# Altium schematic sheet Sheet1.SchDoc
size B; Author: Феликс Лазарев; DrawnBy: Феликс Лазарев; Revision: 1; DocumentName: Контроллер  СF на ПЗУ
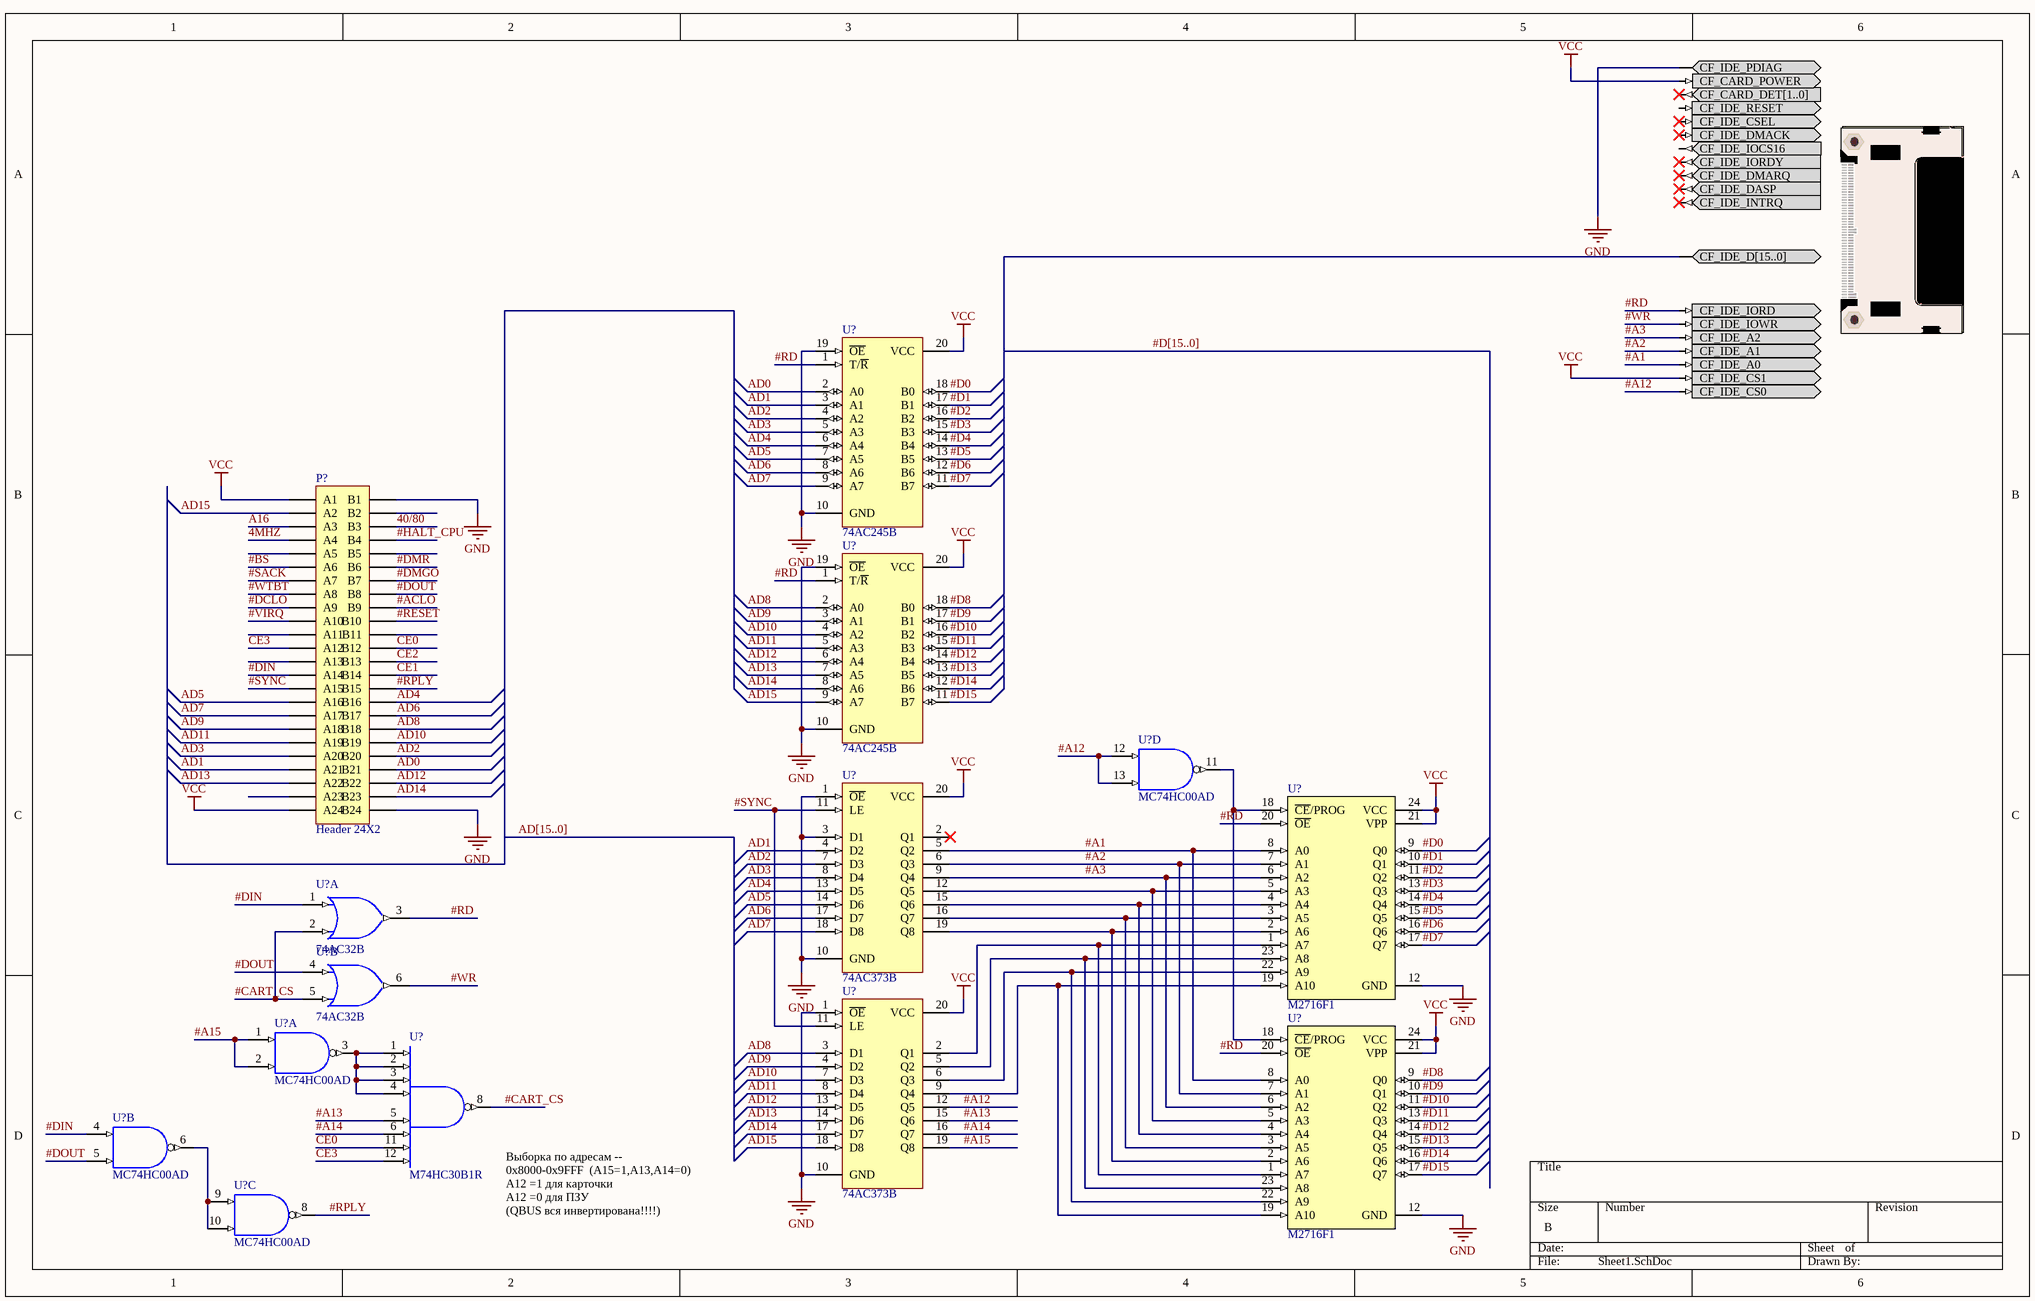
[diagram p0: Sheet1.SchDoc]

## Parts
(Parts that share a designator on the sheet are numbered #1, #2 ... from top to bottom, then left to right.)
?  COMPACT_FLASH  (value not drawn)
P?  Header 24X2  [HDR2X24]
U?#1  74AC245B  [DIP20]
U?#2  74AC245B  [DIP20]
U?#3  MC74HC00AD  [751A-03_N]  (part D of 4)
U?#4  74AC373B  [DIP20]
U?#5  M2716F1  [FDIP24W]
U?#6  74AC32B  [DIP14]  (part A of 4)
U?#7  74AC32B  [DIP14]  (part B of 4)
U?#8  74AC373B  [DIP20]
U?#9  MC74HC00AD  [751A-03_N]  (part A of 4)
U?#10  M2716F1  [FDIP24W]
U?#11  M74HC30B1R  [DIP14]
U?#12  MC74HC00AD  [751A-03_N]  (part B of 4)
U?#13  MC74HC00AD  [751A-03_N]  (part C of 4)

## Nets
GND: ?.CF_IDE_PDIAG P?.2(B1) P?.48(B24) U?#1.10(GND) U?#1.19(~{OE}) U?#2.10(GND) U?#2.19(~{OE}) U?#3.7(GND) U?#4.1(~{OE}) U?#4.3(D1) U?#4.10(GND) U?#5.12(GND) U?#6.7(GND) U?#7.7(GND) U?#8.1(~{OE}) U?#8.10(GND) U?#9.7(GND) U?#10.12(GND) U?#11.7(GND) U?#12.7(GND) U?#13.7(GND)
VCC: ?.CF_CARD_POWER ?.CF_IDE_CS1 P?.1(A1) P?.47(A24) U?#1.20(VCC) U?#2.20(VCC) U?#3.14(VCC) U?#4.20(VCC) U?#5.21(VPP) U?#5.24(VCC) U?#6.14(VCC) U?#7.14(VCC) U?#8.20(VCC) U?#9.14(VCC) U?#10.21(VPP) U?#10.24(VCC) U?#11.14(VCC) U?#12.14(VCC) U?#13.14(VCC)
4MHZ: P?.7(A4)
40/80: P?.6(B3)
#A1: ?.CF_IDE_A0 U?#4.5(Q2) U?#5.8(A0) U?#10.8(A0)
#A2: ?.CF_IDE_A1 U?#4.6(Q3) U?#5.7(A1) U?#10.7(A1)
#A3: ?.CF_IDE_A2 U?#4.9(Q4) U?#5.6(A2) U?#10.6(A2)
#A12: ?.CF_IDE_CS0 U?#3.12(A) U?#3.13(B) U?#8.12(Q5)
#A13: U?#8.15(Q6) U?#11.5(E)
#A14: U?#8.16(Q7) U?#11.6(F)
#A15: U?#8.19(Q8) U?#9.1(A) U?#9.2(B)
#ACLO: P?.18(B9)
#BS: P?.11(A6)
#CART_CS: U?#6.2(B) U?#7.5(B) U?#11.8(Y)
#D0: U?#1.18(B0) U?#5.9(Q0)
#D1: U?#1.17(B1) U?#5.10(Q1)
#D2: U?#1.16(B2) U?#5.11(Q2)
#D3: U?#1.15(B3) U?#5.13(Q3)
#D4: U?#1.14(B4) U?#5.14(Q4)
#D5: U?#1.13(B5) U?#5.15(Q5)
#D6: U?#1.12(B6) U?#5.16(Q6)
#D7: U?#1.11(B7) U?#5.17(Q7)
#D8: U?#2.18(B0) U?#10.9(Q0)
#D9: U?#2.17(B1) U?#10.10(Q1)
#D10: U?#2.16(B2) U?#10.11(Q2)
#D11: U?#2.15(B3) U?#10.13(Q3)
#D12: U?#2.14(B4) U?#10.14(Q4)
#D13: U?#2.13(B5) U?#10.15(Q5)
#D14: U?#2.12(B6) U?#10.16(Q6)
#D15: U?#2.11(B7) U?#10.17(Q7)
#D[15..0]: ?.CF_IDE_D[15..0]
#DCLO: P?.17(A9)
#DIN: P?.27(A14) U?#6.1(A) U?#12.4(A)
#DMGO: P?.14(B7)
#DMR: P?.12(B6)
#DOUT: P?.16(B8) U?#7.4(A) U?#12.5(B)
#HALT_CPU: P?.8(B4)
#RD: ?.CF_IDE_IORD U?#1.1(T/~{R}) U?#2.1(T/~{R}) U?#5.20(~{OE}) U?#6.3(Y) U?#10.20(~{OE})
#RESET: P?.20(B10)
#RPLY: P?.30(B15) U?#13.8(~{Y})
#SACK: P?.13(A7)
#SYNC: P?.29(A15) U?#4.11(LE) U?#8.11(LE)
#VIRQ: P?.19(A10)
#WR: ?.CF_IDE_IOWR U?#7.6(Y)
#WTBT: P?.15(A8)
A16: P?.5(A3)
AD0: P?.42(B21) U?#1.2(A0)
AD1: P?.41(A21) U?#1.3(A1) U?#4.4(D2)
AD2: P?.40(B20) U?#1.4(A2) U?#4.7(D3)
AD3: P?.39(A20) U?#1.5(A3) U?#4.8(D4)
AD4: P?.32(B16) U?#1.6(A4) U?#4.13(D5)
AD5: P?.31(A16) U?#1.7(A5) U?#4.14(D6)
AD6: P?.34(B17) U?#1.8(A6) U?#4.17(D7)
AD7: P?.33(A17) U?#1.9(A7) U?#4.18(D8)
AD8: P?.36(B18) U?#2.2(A0) U?#8.3(D1)
AD9: P?.35(A18) U?#2.3(A1) U?#8.4(D2)
AD10: P?.38(B19) U?#2.4(A2) U?#8.7(D3)
AD11: P?.37(A19) U?#2.5(A3) U?#8.8(D4)
AD12: P?.44(B22) U?#2.6(A4) U?#8.13(D5)
AD13: P?.43(A22) U?#2.7(A5) U?#8.14(D6)
AD14: P?.46(B23) U?#2.8(A6) U?#8.17(D7)
AD15: P?.3(A2) U?#2.9(A7) U?#8.18(D8)
CE0: P?.24(B12) U?#11.11(G)
CE1: P?.28(B14)
CE2: P?.26(B13)
CE3: P?.23(A12) U?#11.12(H)
NetU?#3_11: U?#3.11(~{Y}) U?#5.18(~{CE}/PROG) U?#10.18(~{CE}/PROG)
NetU?#4_12: U?#4.12(Q5) U?#5.5(A3) U?#10.5(A3)
NetU?#4_15: U?#4.15(Q6) U?#5.4(A4) U?#10.4(A4)
NetU?#4_16: U?#4.16(Q7) U?#5.3(A5) U?#10.3(A5)
NetU?#4_19: U?#4.19(Q8) U?#5.2(A6) U?#10.2(A6)
NetU?#5_1: U?#5.1(A7) U?#8.2(Q1) U?#10.1(A7)
NetU?#5_19: U?#5.19(A10) U?#8.9(Q4) U?#10.19(A10)
NetU?#5_22: U?#5.22(A9) U?#8.6(Q3) U?#10.22(A9)
NetU?#5_23: U?#5.23(A8) U?#8.5(Q2) U?#10.23(A8)
NetU?#9_3: U?#9.3(~{Y}) U?#11.1(A) U?#11.2(B) U?#11.3(C) U?#11.4(D)
NetU?#12_6: U?#12.6(~{Y}) U?#13.9(A) U?#13.10(B)

Not connected (* = marked no-connect by the designer): ? CF_CARD_DET[1..0]* CF_IDE_CSEL* CF_IDE_DASP* CF_IDE_DMACK* CF_IDE_DMARQ* CF_IDE_INTRQ* CF_IDE_IOCS16 CF_IDE_IORDY* CF_IDE_RESET; P? 4(B2) 9(A5) 10(B5) 21(A11) 22(B11) 25(A13) 45(A23); U?#4 2(Q1)*

## Buses and harness runs
bus #D[15..0]
bus AD[15..0]

## Notes on the sheet
- (near U?#11) Выборка по адресам --
  0x8000-0x9FFF  (A15=1,A13,A14=0)
  A12 =1 для карточки
  A12 =0 для ПЗУ
  (QBUS вся инвертирована!!!!)

## Library data of the parts
? = COMPACT_FLASH: Connector, Compact Flash Card Ejector 22mm; PortComponent: True; Published: 22-Jan-2007; Publisher: Altium Limited; HelpURL: https://wiki.altium.com/display/ADOH/PB02+Resources+-+CF+Card+Reader
P? = Header 24X2: Header, 24-Pin, Dual row; LatestRevisionDate: 17-Jul-2002; LatestRevisionNote: Re-released for DXP Platform.; Publisher: Altium Limited
U?#1 U?#2 = 74AC245B: Octal Bus Transceiver 3-State Non-Inverting; Published: 8-Jun-2000; LatestRevisionDate: 06-Jun-2005; LatestRevisionNote: Stylized 3D Model Added.; DatasheetVersion: Apr-1997; PackageVersion: Jun-1998; PackageReference: DIP20; Publisher: Altium Limited; PackageDescription: DIP; 20 Leads; Row Spacing 7.62 mm; Pitch 2.54 mm; Code_JEDEC: MS-015-AE; ComponentLink1Description: Manufacturer Link; ComponentLink1URL: http://www.st.com/; ComponentLink2Description: Datasheet; ComponentLink2URL: http://www.st.com/stonline/products/literature/ds/4699/74ac245.pdf
U?#3 U?#9 U?#12 U?#13 = MC74HC00AD: Quad 2-Input NAND Gate; Published: 15-Apr-2002; LatestRevisionDate: 13-Apr-2006; LatestRevisionNote: IPC-7351 Footprint Added.; DatasheetVersion: Mar-2000; PackageReference: 751A-03; Publisher: Altium Limited; PackageDescription: 14-Pin Small Outline Integrated Circuit 1.27 mm Pitch; Code_JEDEC: MS-012-AB; Code_IPC: SOIC127P600-14; ComponentLink1Description: Manufacturer Link; ComponentLink1URL: http://www.onsemi.com/; ComponentLink2Description: Datasheet; ComponentLink2URL: http://www.onsemi.com/pub/Collateral/MC74HC00A-D.PDF
U?#4 U?#8 = 74AC373B: Octal D-Type Latch with 3-State Output Non-Inverting; Published: 8-Jun-2000; LatestRevisionDate: 06-Jun-2005; LatestRevisionNote: Stylized 3D Model Added.; DatasheetVersion: Apr-1997; PackageVersion: Jun-1998; PackageReference: DIP20; Publisher: Altium Limited; PackageDescription: DIP; 20 Leads; Row Spacing 7.62 mm; Pitch 2.54 mm; Code_JEDEC: MS-015-AE; ComponentLink1Description: Manufacturer Link; ComponentLink1URL: http://www.st.com/; ComponentLink2Description: Datasheet; ComponentLink2URL: http://www.st.com/stonline/products/literature/ds/4937/74ac373.pdf
U?#5 U?#10 = M2716F1: NMOS 16K (2K x 8) UV EPROM; Published: 24-Aug-2001; LatestRevisionDate: 06-Jun-2005; LatestRevisionNote: Stylized 3D Model Added.; DatasheetVersion: Jul-1994; PackageReference: FDIP24W; Publisher: Altium Limited; PackageDescription: Ceramic Frit-seal DIP, Window; 24 Leads; Row Spacing 15.24 mm; Pitch 2.54 mm; ComponentLink1Description: Manufacturer Link; ComponentLink1URL: http://www.st.com/
U?#6 U?#7 = 74AC32B: Quad 2-Input OR Gate; Published: 8-Jun-2000; LatestRevisionDate: 06-Jun-2005; LatestRevisionNote: Stylized 3D Model Added.; DatasheetVersion: Apr-1997; PackageVersion: Jan-1997; PackageReference: DIP14; Publisher: Altium Limited; PackageDescription: DIP; 14 Leads; Row Spacing 7.62 mm; Pitch 2.54 mm; ComponentLink1Description: Manufacturer Link; ComponentLink1URL: http://www.st.com/; ComponentLink2Description: Datasheet; ComponentLink2URL: http://www.st.com/stonline/products/literature/ds/4695/74ac32.pdf
U?#11 = M74HC30B1R: 8-Input NAND Gate; Note: Pins 9, 10 and 13 are not connected and not drawn.; Published: 8-Jun-2000; LatestRevisionDate: 06-Jun-2005; LatestRevisionNote: Stylized 3D Model Added.; DatasheetVersion: Feb-1993; PackageVersion: Jan-1997; PackageReference: DIP14; Publisher: Altium Limited; PackageDescription: DIP; 14 Leads; Row Spacing 7.62 mm; Pitch 2.54 mm; ComponentLink1Description: Manufacturer Link; ComponentLink1URL: http://www.st.com/; ComponentLink2Description: Datasheet; ComponentLink2URL: http://www.st.com/stonline/products/literature/ds/1943/m74hc30.pdf